# EAGLE design v2 (EAGLE 9.6.1)
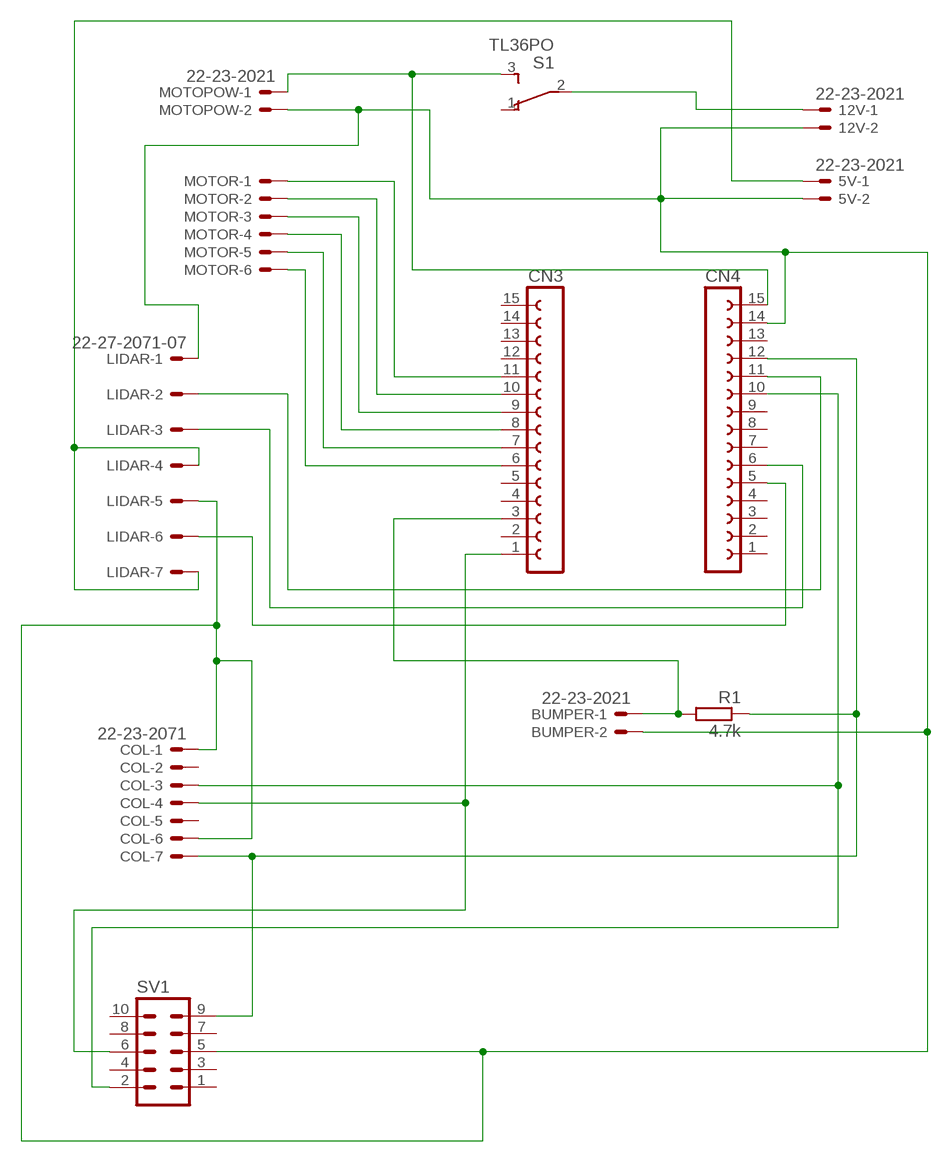
[diagram p0: schematic, sheet 1]

## Parts
5V  22-23-2021  [22-23-2021]
12V  22-23-2021  [22-23-2021]
BUMPER  22-23-2021  [22-23-2021]
CN3  FE15-1  [FE15]
CN4  FE15-1  [FE15]
COL  22-23-2071  [22-23-2071]
LIDAR  22-27-2071-07  [6410-07]
MOTOPOW  22-23-2021  [22-23-2021]
MOTOR  22-23-2061  [22-23-2061]
R1  4.7k  R-EU_R1206  [R1206]
S1  TL36PO  [TL3XPO]
SV1  MA05-2  [MA05-2]

## Nets
N$1: 12V.1 S1.2(P)
N$2: CN4.15 MOTOPOW.1 S1.3(S)
N$3: 5V.2 12V.2 BUMPER.2 CN4.14 COL.1 COL.6 LIDAR.1 LIDAR.5 MOTOPOW.2 SV1.5
N$4: 5V.1 LIDAR.4 LIDAR.7
N$5: CN3.11 MOTOR.1
N$6: CN3.10 MOTOR.2
N$7: CN3.9 MOTOR.3
N$8: CN3.8 MOTOR.4
N$9: CN3.7 MOTOR.5
N$10: CN3.6 MOTOR.6
N$11: CN4.5 LIDAR.6
N$12: CN4.11 LIDAR.2
N$13: CN4.6 LIDAR.3
N$14: CN3.1 COL.4 SV1.6
N$15: CN4.10 COL.3 SV1.2
N$16: BUMPER.1 CN3.3 R1.2
N$17: CN4.12 COL.7 R1.1 SV1.9
Unconnected: CN3.2 CN3.4 CN3.5 CN3.12 CN3.13 CN3.14 CN3.15 CN4.1 CN4.2 CN4.3 CN4.4 CN4.7 CN4.8 CN4.9 CN4.13 COL.2 COL.5 S1.1(O) SV1.1 SV1.3 SV1.4 SV1.7 SV1.8 SV1.10

## Library data of the parts
5V 12V BUMPER MOTOPOW = con-molex:22-23-2021: .100" (2.54mm) Center Header - 2 Pin; MF: MOLEX; MPN: 22-23-2021; OC_FARNELL: 1462926; OC_NEWARK: 25C3832
CN3 CN4 = con-lsta:FE15-1: FEMALE HEADER; OC_FARNELL: unknown; OC_NEWARK: unknown
COL = con-molex:22-23-2071: .100" (2.54mm) Center Header - 7 Pin; MF: MOLEX; MPN: 22-23-2071; OC_FARNELL: 1654534; OC_NEWARK: 56H0445
LIDAR = con-molex:22-?-07: CONNECTOR wire to board 2.54 mm (.1 inch) pitch header; MF: MOLEX; OC_FARNELL: unknown; OC_NEWARK: unknown
MOTOR = con-molex:22-23-2061: .100" (2.54mm) Center Header - 6 Pin; MF: MOLEX; MPN: 22-23-2061; OC_FARNELL: 1462922; OC_NEWARK: 27C1933
R1 = rcl:R-EU_: RESISTOR, European symbol; SPICEPREFIX: R
S1 = switch:TL36PO: TINY SWITCH ON - ON Source: http://www2.produktinfo.conrad.com/datenblaetter/700000-724999/705152-da-01-de-Subminiaturschalter_TL_36YO.pdf
SV1 = con-lstb:MA05-2: PIN HEADER; OC_FARNELL: unknown; OC_NEWARK: unknown

## Board
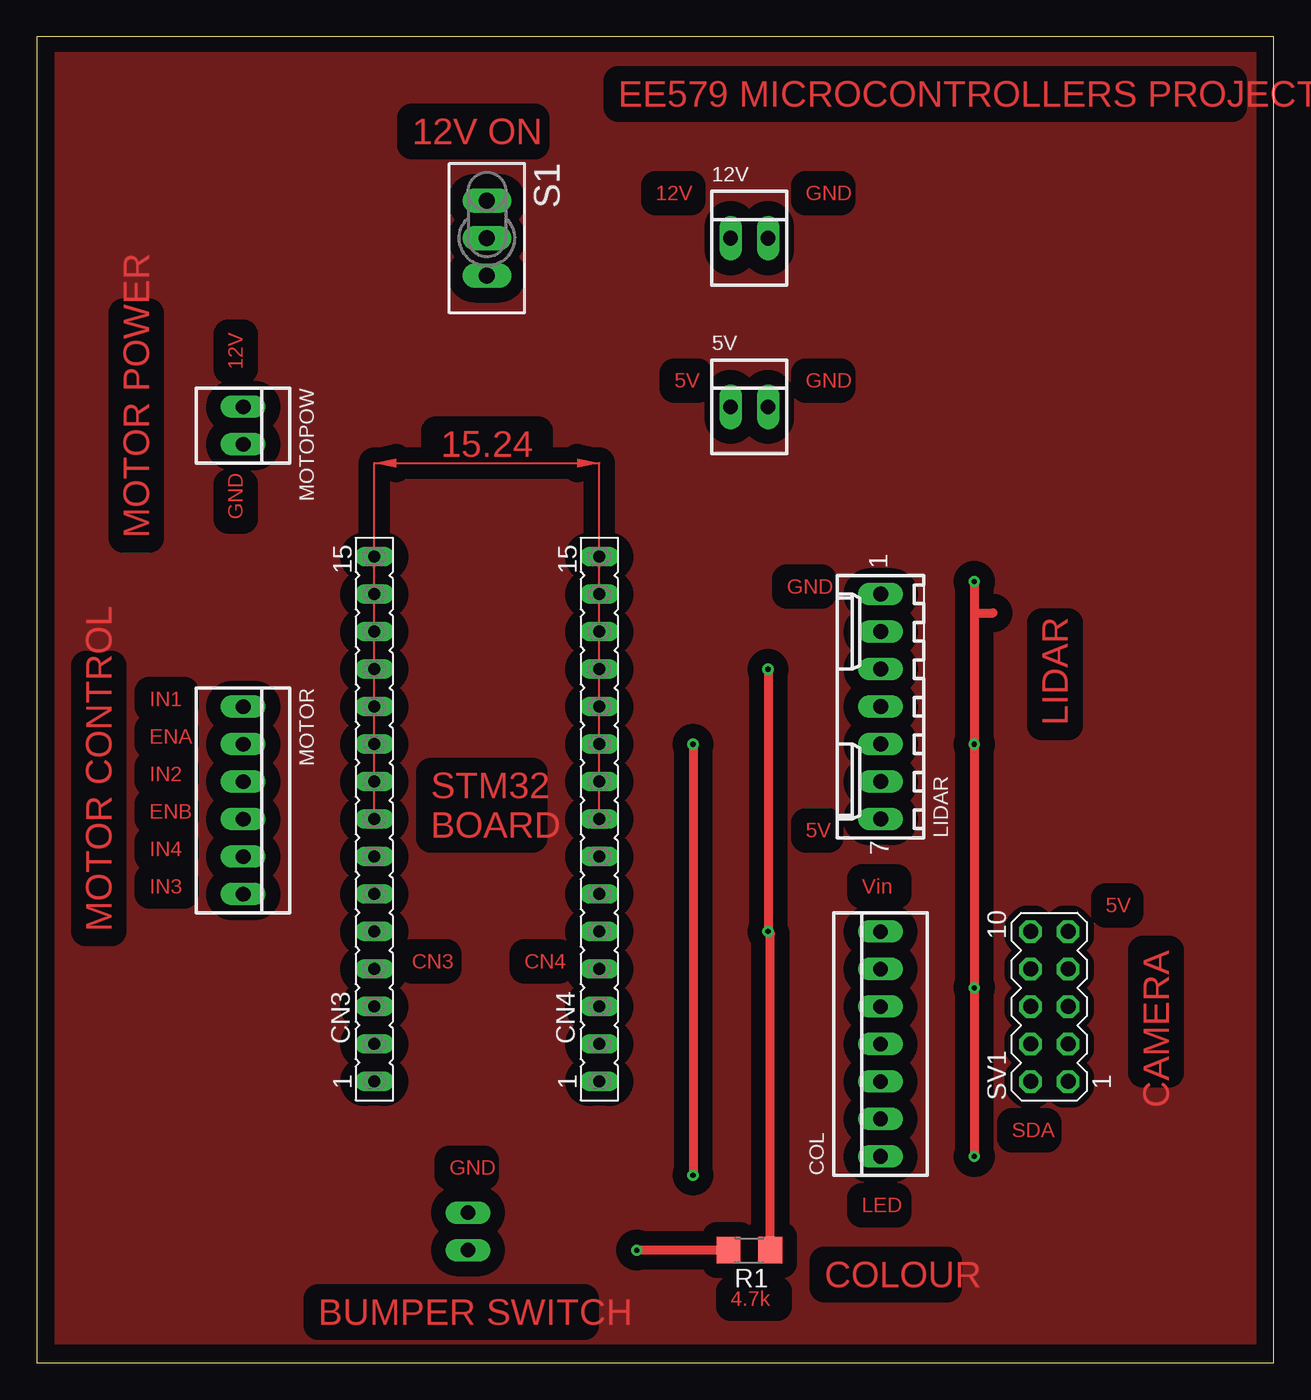
[diagram p1: board, top side]
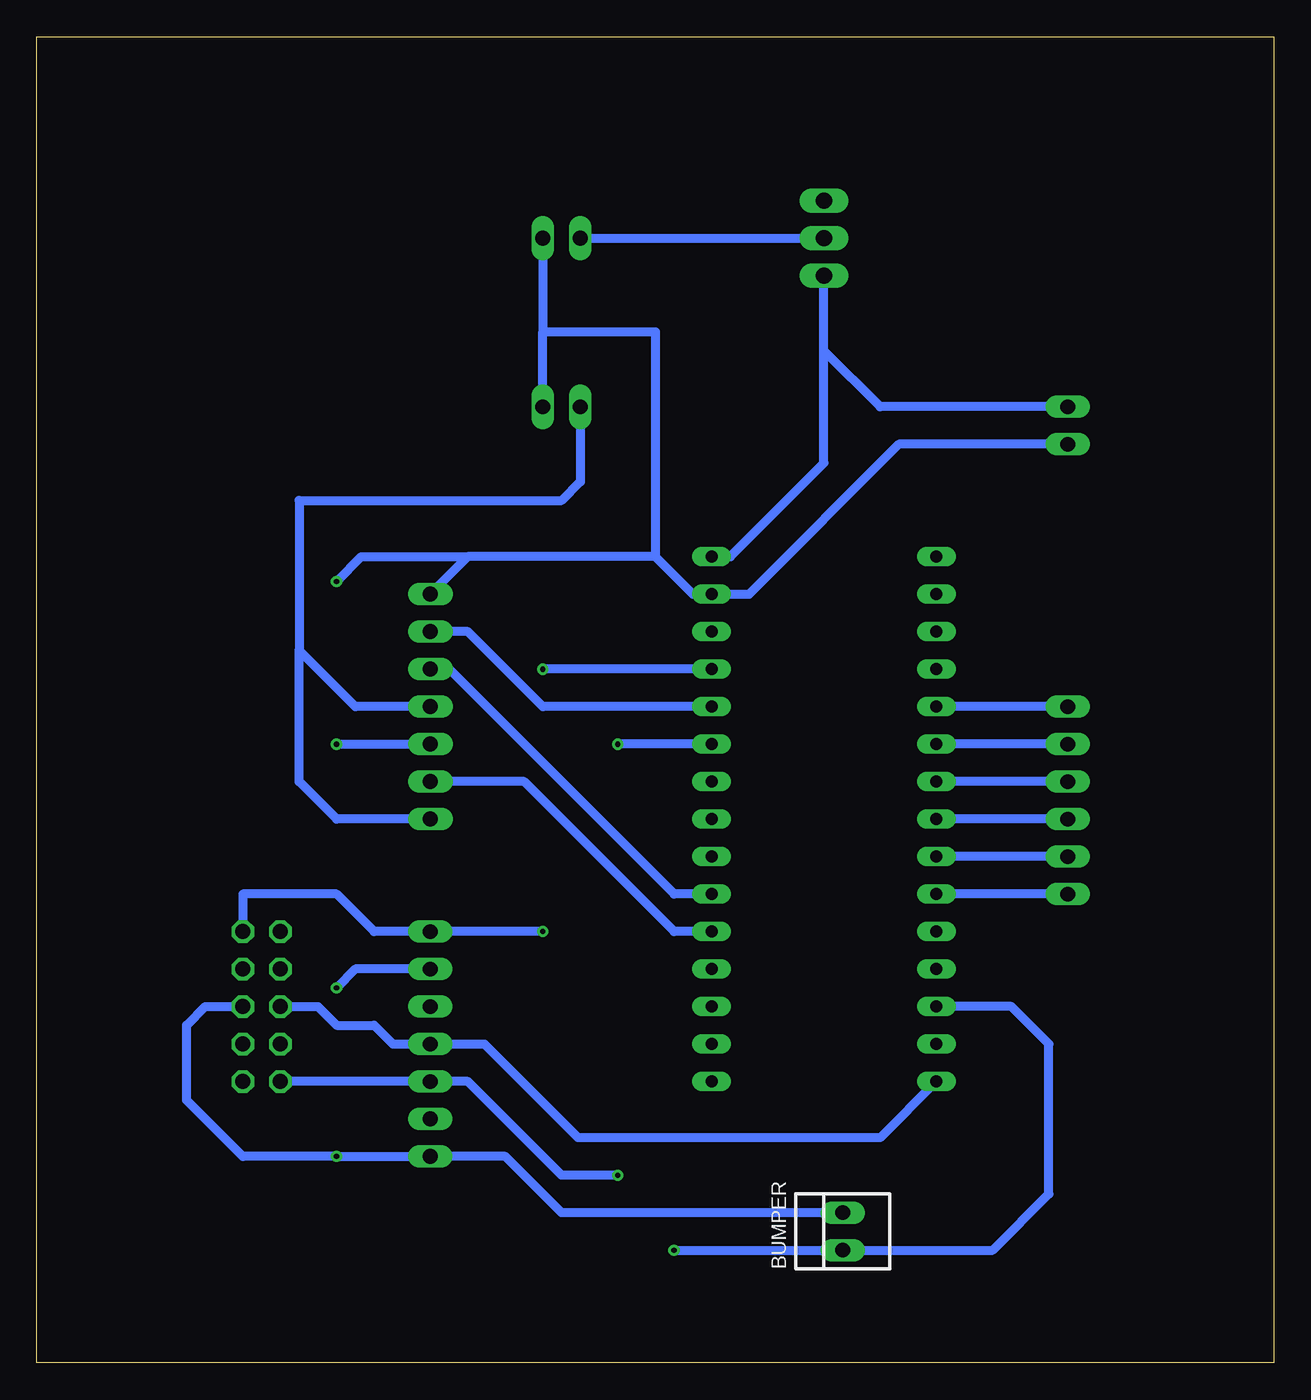
[diagram p2: board, bottom side, seen from below]

Size 83.8 x 89.84 mm. Coordinates in mm from the lower left corner, seen from the top.
Outline: 0,0 83.8,0 83.8,89.84 0,89.84 0,0
Copper layers (1*16): Top 0.035mm / dielectric 1.5mm / Bottom 0.035mm
Design rules "default *": minimum track width 0.6mm, minimum drill 0.1mm, track to track 1mm, track to pad 1mm, pad to pad 1mm, via to via 1mm, smd to smd 8mil, copper to edge 40mil, drill to drill 6mil, minimum pad ring 10mil, minimum via ring 8mil, stop-mask expansion 4mil, vias tented up to drill 0mil, thermal gap 10mil

### Footprints (pad centres in the part's own frame; a part is rotated, then mirrored left to right if it is on the bottom)
22-23-2021 = drill 1 long: 1 -1.27,0; 2 1.27,0
FE15 = drill 0.813 long: 1 -17.78,0; 2 -15.24,0; 3 -12.7,0; 4 -10.16,0; 5 -7.62,0; 6 -5.08,0; 7 -2.54,0; 8 0,0; 9 2.54,0; 10 5.08,0; 11 7.62,0; 12 10.16,0; 13 12.7,0; 14 15.24,0; 15 17.78,0
22-23-2071 = drill 1 long: 1 -7.62,0; 2 -5.08,0; 3 -2.54,0; 4 0,0; 5 2.54,0; 6 5.08,0; 7 7.62,0
6410-07 = drill 1.016 long: 1 7.62,0; 2 5.08,0; 3 2.54,0; 4 0,0; 5 -2.54,0; 6 -5.08,0; 7 -7.62,0
22-23-2061 = drill 1 long: 1 -6.35,0; 2 -3.81,0; 3 -1.27,0; 4 1.27,0; 5 3.81,0; 6 6.35,0
R1206 = smd 1.6 x 1.803: 1 -1.422,0; 2 1.422,0
TL3XPO = drill 1.1 pad 1.422 long: 1 -2.54,0; 2 0,0; 3 2.54,0
MA05-2 = drill 1.016 octagon: 1 -5.08,-1.27; 2 -5.08,1.27; 3 -2.54,-1.27; 4 -2.54,1.27; 5 0,-1.27; 6 0,1.27; 7 2.54,-1.27; 8 2.54,1.27; 9 5.08,-1.27; 10 5.08,1.27

### Placement (x,y rotation side)
5V  48.26,64.77 0 top
12V  48.26,76.2 0 top
BUMPER  29.21,8.89 90 bottom
CN3  22.86,36.83 90 top
CN4  38.1,36.83 90 top
COL  57.15,21.59 90 top
LIDAR  57.15,44.45 90 top
MOTOPOW  13.97,63.5 270 top
MOTOR  13.97,38.1 270 top
R1  48.26,7.62 180 top
S1  30.48,76.2 270 top
SV1  68.58,24.13 90 top

### Tracks (layer width: path | path; a pad name or v marks a point on that pad's centre or on a via)
GND
  pour Top: 1.27,88.9 82.55,88.9 82.55,1.27 1.27,1.27
N$1
  Bottom 0.6: 12V.1 S1.2
N$2
  Bottom 0.6: CN4.15 36.83,54.61 30.48,60.96 30.48,68.58 | 30.48,68.58 S1.3 | 30.48,68.58 26.67,64.77 MOTOPOW.1
N$3  (via drill 0.35)
  Top 0.6: v63.5,13.97 v63.5,25.4 v63.5,41.91 63.5,50.8 | v63.5,52.93 63.5,50.8 | 63.5,50.8 64.77,50.8
  Bottom 0.6: 5V.2 49.53,69.85 | 12V.2 49.53,69.85 | 49.53,69.85 41.91,69.85 41.91,54.61 | 41.91,54.61 39.37,52.07 CN4.14 35.56,52.07 25.4,62.23 MOTOPOW.2 | 41.91,54.61 54.61,54.61 | 54.61,54.61 LIDAR.1 | COL.6 62.23,26.67 v63.5,25.4 | v63.5,52.93 61.82,54.61 54.61,54.61 | v63.5,41.91 LIDAR.5 | SV1.5 72.39,24.13 73.66,22.86 73.66,17.78 69.85,13.97 v63.5,13.97 COL.1 52.07,13.97 48.26,10.16 BUMPER.2
N$4
  Bottom 0.6: 5V.1 46.99,59.69 48.26,58.42 66.04,58.42 66.04,48.26 | LIDAR.7 63.5,36.83 66.04,39.37 66.04,48.26 | LIDAR.4 62.23,44.45 66.04,48.26
N$5
  Bottom 0.6: MOTOR.1 CN3.11
N$6
  Bottom 0.6: MOTOR.2 CN3.10
N$7
  Bottom 0.6: MOTOR.3 CN3.9
N$8
  Bottom 0.6: MOTOR.4 CN3.8
N$9
  Bottom 0.6: MOTOR.5 CN3.7
N$10
  Bottom 0.6: MOTOR.6 CN3.6
N$11
  Bottom 0.6: CN4.5 40.64,29.21 50.8,39.37 LIDAR.6
N$12
  Bottom 0.6: CN4.11 49.53,44.45 54.61,49.53 LIDAR.2
N$13
  Bottom 0.6: CN4.6 40.64,31.75 55.88,46.99 LIDAR.3
N$14
  Bottom 0.6: CN3.1 26.67,15.24 47.14,15.24 53.49,21.59 COL.4 59.69,21.59 60.96,22.86 63.5,22.86 64.77,24.13 SV1.6
N$15  (via drill 0.35)
  Top 0.6: v44.45,41.91 v44.45,12.7
  Bottom 0.6: SV1.2 COL.3 54.61,19.05 48.26,12.7 v44.45,12.7 | CN4.10 v44.45,41.91
N$16  (via drill 0.35)
  Top 0.6: R1.2 v40.64,7.62
  Bottom 0.6: CN3.3 17.78,24.13 15.24,21.59 15.24,11.43 19.05,7.62 BUMPER.1 v40.64,7.62
N$17  (via drill 0.35)
  Top 0.6: v49.53,46.99 v49.53,29.21 49.68,29.06 R1.1
  Bottom 0.6: CN4.12 v49.53,46.99 | v49.53,29.21 COL.7 60.96,29.21 63.5,31.75 69.85,31.75 SV1.9
(copper drawn outside any net)
  shapes: Top area x1

### Text on the board
Top: EE579 MICROCONTROLLERS PROJECT | 12V ON | 12V | GND | 12V | 5V | GND | GND | MOTOR POWER | GND | IN1 | LIDAR | ENA | IN2 | ENB | STM32 / BOARD | 5V | IN4 | IN3 | Vin | 5V | MOTOR CONTROL | CAMERA | CN3 | CN4 | SDA | GND | LED | COLOUR | 4.7k | BUMPER SWITCH